# EAGLE design macboard (EAGLE 6.3)
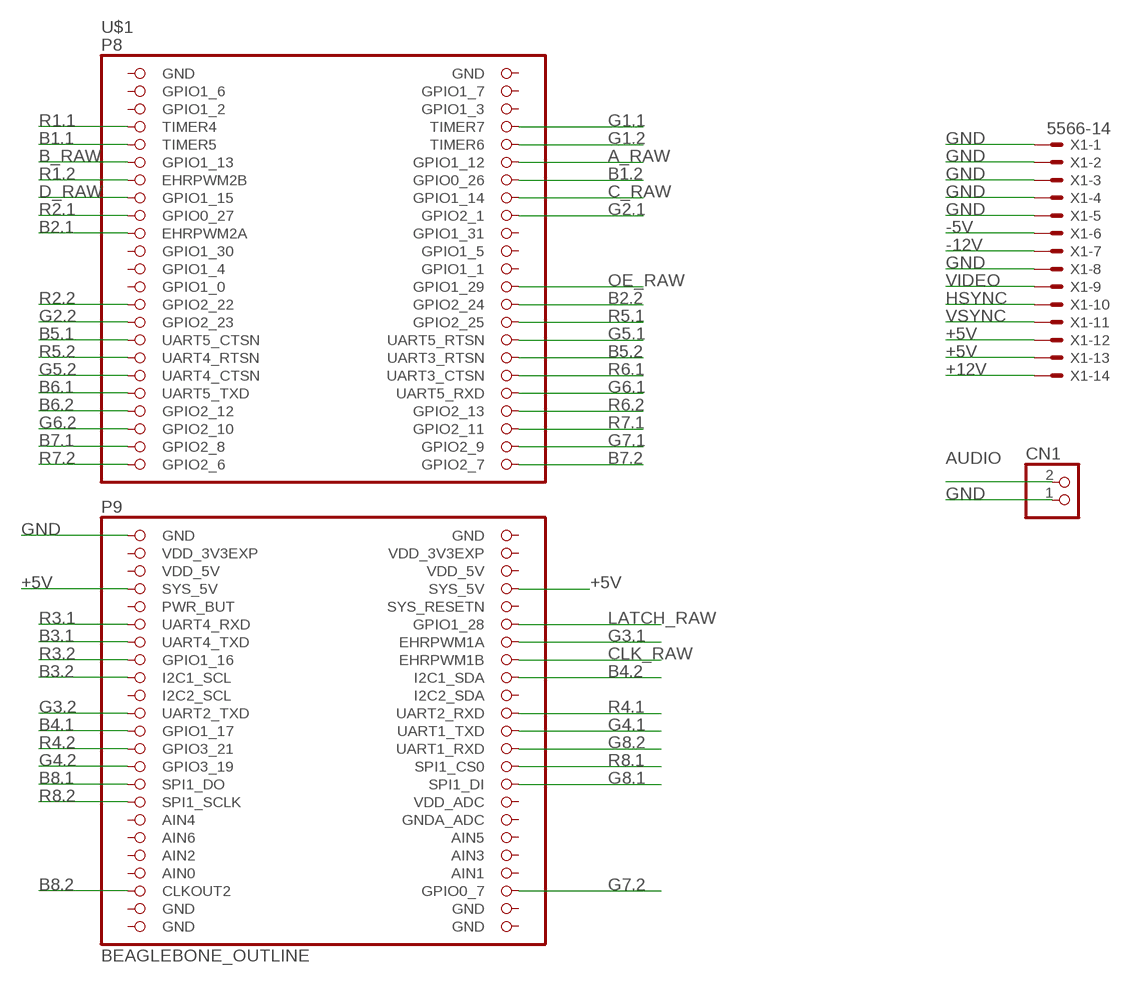
[diagram p0: schematic, sheet 1]

## Parts
CN1  JST_2PIN-THM  [JST-PH-2-THM]
U$1  BEAGLEBONE_OUTLINE  [BEAGLEBONE_SHIELD]
X1  5566-14  [5566-14]

## Nets
+5V: U$1.53(SYS_5V) U$1.54(SYS_5V) X1.12 X1.13
+12V: X1.14
-5V: X1.6
-12V: X1.7
A_RAW: U$1.12(GPIO1_12)
AUDIO: CN1.2
B1.1: U$1.9(TIMER5)
B1.2: U$1.14(GPIO0_26)
B2.1: U$1.19(EHRPWM2A)
B2.2: U$1.28(GPIO2_24)
B3.1: U$1.59(UART4_TXD)
B3.2: U$1.63(I2C1_SCL)
B4.1: U$1.69(GPIO1_17)
B4.2: U$1.64(I2C1_SDA)
B5.1: U$1.31(UART5_CTSN)
B5.2: U$1.34(UART3_RTSN)
B6.1: U$1.37(UART5_TXD)
B6.2: U$1.39(GPIO2_12)
B7.1: U$1.43(GPIO2_8)
B7.2: U$1.46(GPIO2_7)
B8.1: U$1.75(SPI1_DO)
B8.2: U$1.87(CLKOUT2)
B_RAW: U$1.11(GPIO1_13)
C_RAW: U$1.16(GPIO1_14)
CLK_RAW: U$1.62(EHRPWM1B)
D_RAW: U$1.15(GPIO1_15)
G1.1: U$1.8(TIMER7)
G1.2: U$1.10(TIMER6)
G2.1: U$1.18(GPIO2_1)
G2.2: U$1.29(GPIO2_23)
G3.1: U$1.60(EHRPWM1A)
G3.2: U$1.67(UART2_TXD)
G4.1: U$1.70(UART1_TXD)
G4.2: U$1.73(GPIO3_19)
G5.1: U$1.32(UART5_RTSN)
G5.2: U$1.35(UART4_CTSN)
G6.1: U$1.38(UART5_RXD)
G6.2: U$1.41(GPIO2_10)
G7.1: U$1.44(GPIO2_9)
G7.2: U$1.88(GPIO0_7)
G8.1: U$1.76(SPI1_DI)
G8.2: U$1.72(UART1_RXD)
GND: CN1.1 U$1.47(GND) X1.1 X1.2 X1.3 X1.4 X1.5 X1.8
HSYNC: X1.10
LATCH_RAW: U$1.58(GPIO1_28)
OE_RAW: U$1.26(GPIO1_29)
R1.1: U$1.7(TIMER4)
R1.2: U$1.13(EHRPWM2B)
R2.1: U$1.17(GPIO0_27)
R2.2: U$1.27(GPIO2_22)
R3.1: U$1.57(UART4_RXD)
R3.2: U$1.61(GPIO1_16)
R4.1: U$1.68(UART2_RXD)
R4.2: U$1.71(GPIO3_21)
R5.1: U$1.30(GPIO2_25)
R5.2: U$1.33(UART4_RTSN)
R6.1: U$1.36(UART3_CTSN)
R6.2: U$1.40(GPIO2_13)
R7.1: U$1.42(GPIO2_11)
R7.2: U$1.45(GPIO2_6)
R8.1: U$1.74(SPI1_CS0)
R8.2: U$1.77(SPI1_SCLK)
VIDEO: X1.9
VSYNC: X1.11
Unconnected: U$1.3(GPIO1_6) U$1.4(GPIO1_7) U$1.5(GPIO1_2) U$1.6(GPIO1_3) U$1.20(GPIO1_31) U$1.21(GPIO1_30) U$1.22(GPIO1_5) U$1.23(GPIO1_4) U$1.24(GPIO1_1) U$1.25(GPIO1_0) U$1.55(PWR_BUT) U$1.56(SYS_RESETN) U$1.65(I2C2_SCL) U$1.66(I2C2_SDA) U$1.78(VDD_ADC) U$1.79(AIN4) U$1.80(GNDA_ADC) U$1.81(AIN6) U$1.82(AIN5) U$1.83(AIN2) U$1.84(AIN3) U$1.86(AIN1)

## Power pins joined to a net without a drawn wire
AIN0: U$1.85(AIN0)
GND: U$1.1(GND) U$1.2(GND) U$1.48(GND) U$1.89(GND) U$1.90(GND) U$1.91(GND) U$1.92(GND)
VDD_3V3EXP: U$1.49(VDD_3V3EXP) U$1.50(VDD_3V3EXP)
VDD_5V: U$1.51(VDD_5V) U$1.52(VDD_5V)

## Library data of the parts
CN1 = adafruit:JST_2PIN: JST 2-Pin Connectors of various flavors SMT-RA (S2B-PH-SM4) 4UConnector #17311 SMT (B2B-PH-SM4) THM-RA (S2B-PH) THM (B2B-PH)
U$1 = adafruit:BEAGLEBONE_OUTLINE: Should match A3 pinout - but not completely tested
X1 = con-molex:5566-14: Mini FIT connector 14 pol Source: http://www.molex.com; OC_FARNELL: unknown; OC_NEWARK: unknown

## Net classes
0 default: width 0.254 mm

## Board
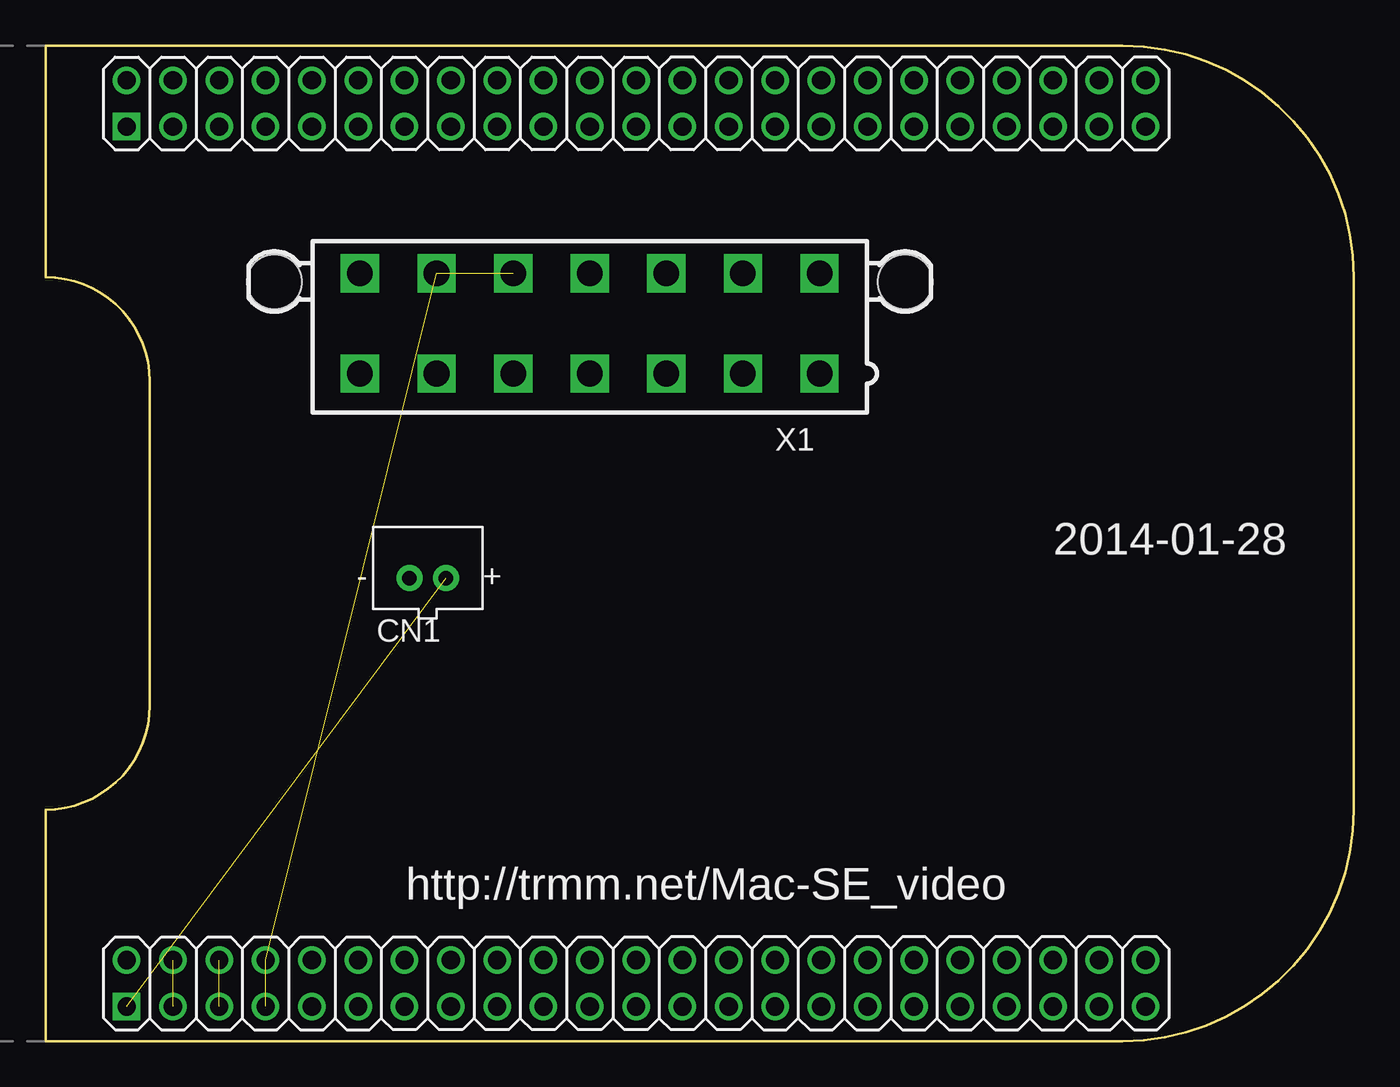
[diagram p1: board, top side]
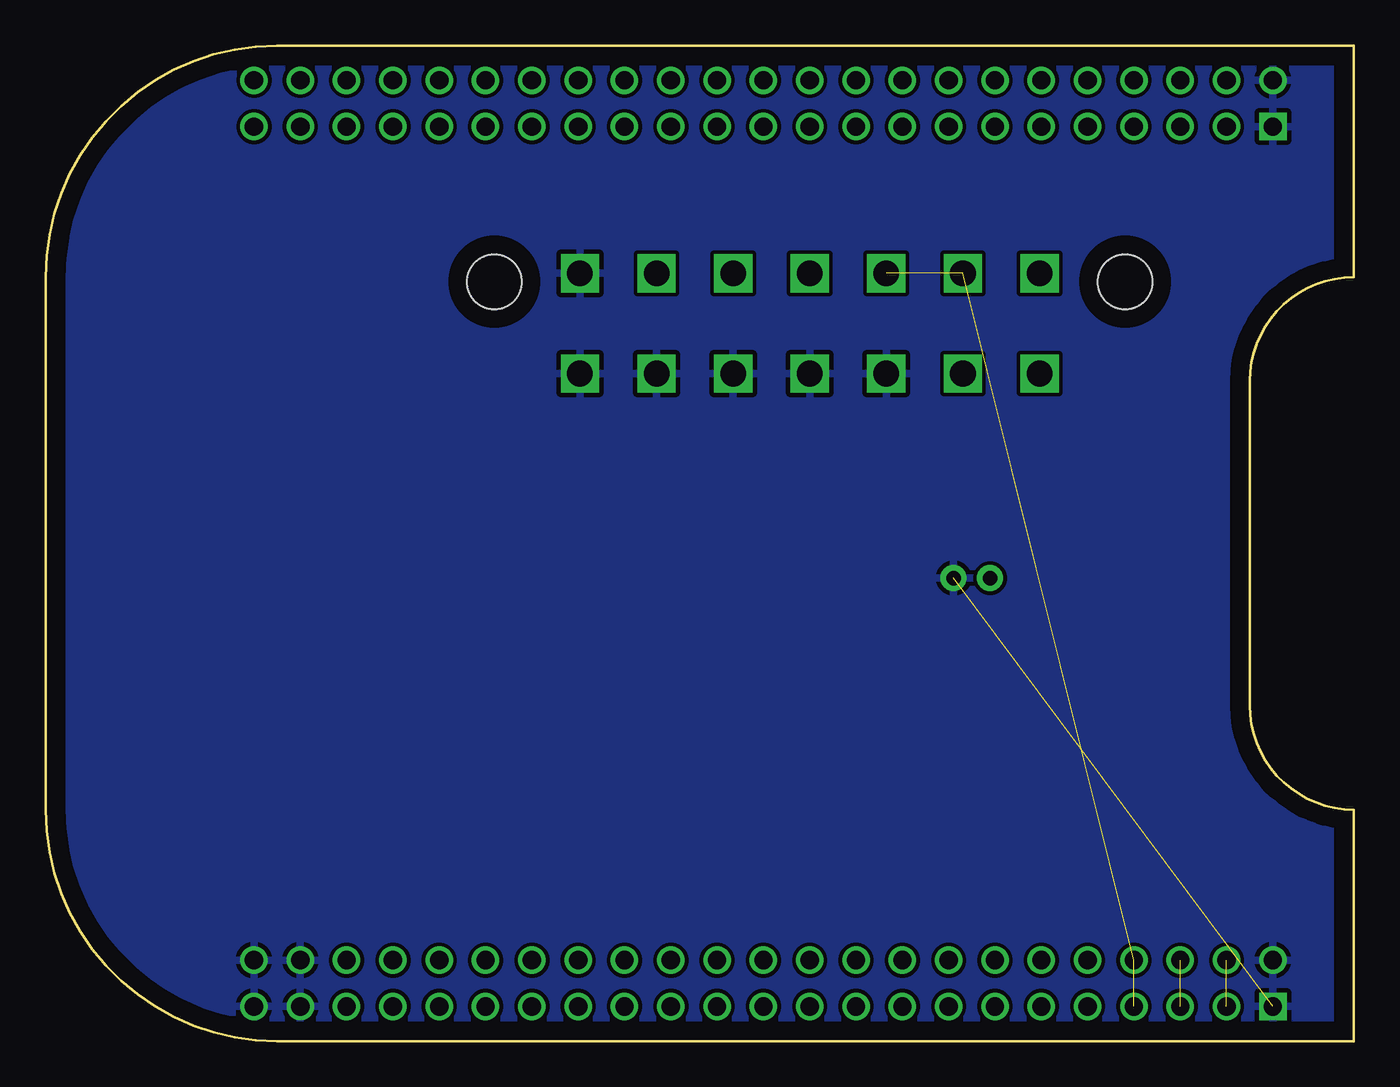
[diagram p2: board, bottom side, seen from below]

Size 71.76 x 54.61 mm. Coordinates in mm from the lower left corner, seen from the top.
Copper layers (1*16): Top 0.035mm / dielectric 1.5mm / Bottom 0.035mm
Design rules "default": minimum track width 10mil, minimum drill 24mil, track to track 8mil, track to pad 8mil, pad to pad 8mil, via to via 8mil, smd to smd 8mil, copper to edge 40mil, drill to drill 8mil, minimum pad ring 10mil, minimum via ring 8mil, stop-mask expansion 4mil, vias tented up to drill 0mil, thermal gap 10mil

### Footprints (pad centres in the part's own frame; a part is rotated, then mirrored left to right if it is on the bottom)
JST-PH-2-THM = drill 0.8 pad 1.422: 1 1,0; 2 -1,0
BEAGLEBONE_SHIELD = drill 1 square: 1 4.445,19.05; 47 52.705,19.05 | drill 1: 2 1.905,19.05; 3 4.445,21.59; 4 1.905,21.59; 5 4.445,24.13; 6 1.905,24.13; 7 4.445,26.67; 8 1.905,26.67; 9 4.445,29.21; 10 1.905,29.21; 11 4.445,31.75; 12 1.905,31.75; 13 4.445,34.29; 14 1.905,34.29; 15 4.445,36.83; 16 1.905,36.83; 17 4.445,39.37; 18 1.905,39.37; 19 4.445,41.91; 20 1.905,41.91; 21 4.445,44.45; 22 1.905,44.45; 23 4.445,46.99; 24 1.905,46.99; 25 4.445,49.53; 26 1.905,49.53; 27 4.445,52.07; 28 1.905,52.07; 29 4.445,54.61; 30 1.905,54.61; 31 4.445,57.15; 32 1.905,57.15; 33 4.445,59.69; 34 1.905,59.69; 35 4.445,62.23; 36 1.905,62.23; 37 4.445,64.77; 38 1.905,64.77; 39 4.445,67.31; 40 1.905,67.31; 41 4.445,69.85; 42 1.905,69.85; 43 4.445,72.39; 44 1.905,72.39; 45 4.445,74.93; 46 1.905,74.93; 48 50.165,19.05; 49 52.705,21.59; 50 50.165,21.59; 51 52.705,24.13; 52 50.165,24.13; 53 52.705,26.67; 54 50.165,26.67; 55 52.705,29.21; 56 50.165,29.21; 57 52.705,31.75; 58 50.165,31.75; 59 52.705,34.29; 60 50.165,34.29; 61 52.705,36.83; 62 50.165,36.83; 63 52.705,39.37; 64 50.165,39.37; 65 52.705,41.91; 66 50.165,41.91; 67 52.705,44.45; 68 50.165,44.45; 69 52.705,46.99; 70 50.165,46.99; 71 52.705,49.53; 72 50.165,49.53; 73 52.705,52.07; 74 50.165,52.07; 75 52.705,54.61; 76 50.165,54.61; 77 52.705,57.15; 78 50.165,57.15; 79 52.705,59.69; 80 50.165,59.69; 81 52.705,62.23; 82 50.165,62.23; 83 52.705,64.77; 84 50.165,64.77; 85 52.705,67.31; 86 50.165,67.31; 87 52.705,69.85; 88 50.165,69.85; 89 52.705,72.39; 90 50.165,72.39; 91 52.705,74.93; 92 50.165,74.93
5566-14 = drill 1.4 square: 1 12.6,-2.75; 2 8.4,-2.75; 3 4.2,-2.75; 4 0,-2.75; 5 -4.2,-2.75; 6 -8.4,-2.75; 7 -12.6,-2.75; 8 12.6,2.75; 9 8.4,2.75; 10 4.2,2.75; 11 0,2.75; 12 -4.2,2.75; 13 -8.4,2.75; 14 -12.6,2.75 | hole 3: 17.3,2.29; -17.3,2.29

### Placement (x,y rotation side)
CN1  20.96,25.4 0 top
U$1  -14.61,54.61 270 top
X1  29.85,39.37 0 top

### Tracks (layer width: path | path; a pad name or v marks a point on that pad's centre or on a via)
+5V  (3 unrouted)
GND  (1 unrouted)
  pour Bottom: 0.64,54.61 71.76,54.61 71.76,0 0.64,0
VDD_3V3EXP  (1 unrouted)
VDD_5V  (1 unrouted)

### Text on the board
tNames: 2014-01-28 | http://trmm.net/Mac-SE_video